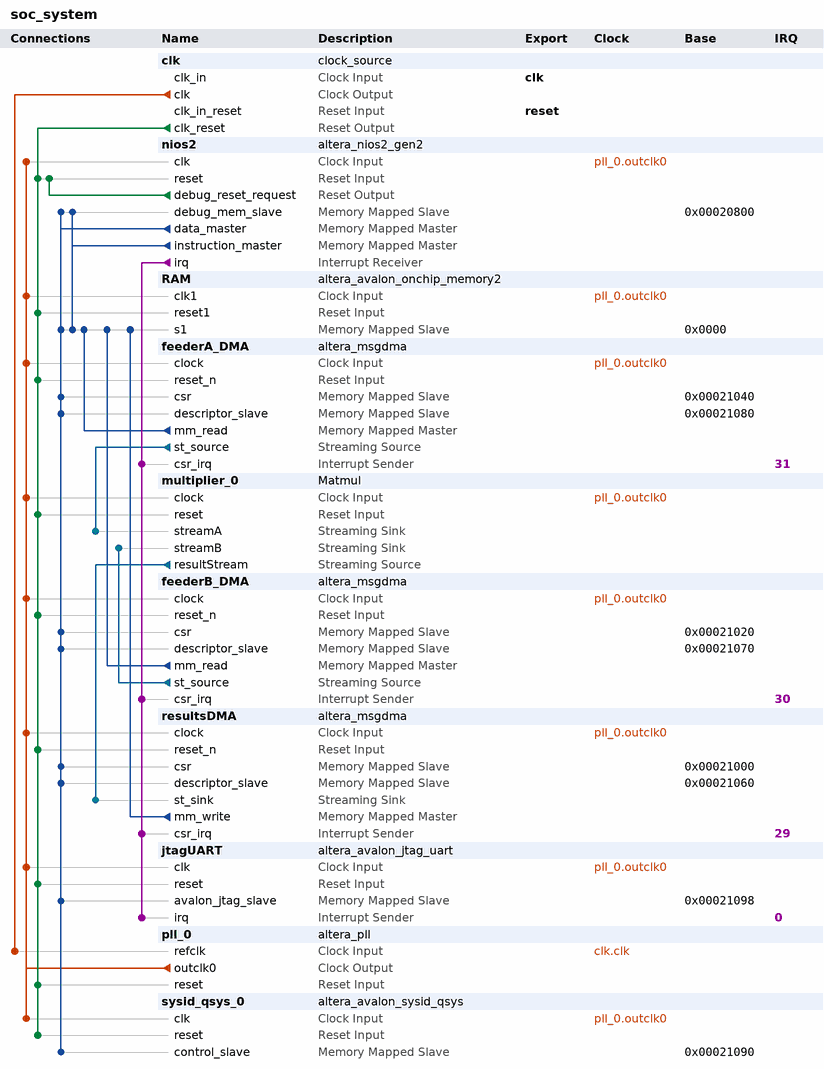
[diagram p0: system contents]
# Platform Designer (Qsys) system soc_system, Cyclone V 5CSEBA6U23I7
# Parameters at their usual value, and those the tool derives, are not listed.
package require -exact qsys 16.0
create_system soc_system
set_project_property DEVICE_FAMILY {Cyclone V}
set_project_property DEVICE 5CSEBA6U23I7

add_instance clk clock_source 16.0
set_instance_parameter_value clk clockFrequency 50000000

add_instance nios2 altera_nios2_gen2 16.0
set_instance_parameter_value nios2 dcache_size 2048
set_instance_parameter_value nios2 exceptionSlave RAM.s1
set_instance_parameter_value nios2 icache_size 4096
set_instance_parameter_value nios2 impl Tiny
set_instance_parameter_value nios2 resetSlave RAM.s1

add_instance RAM altera_avalon_onchip_memory2 16.0
set_instance_parameter_value RAM dataWidth 32
set_instance_parameter_value RAM dualPort false
set_instance_parameter_value RAM initMemContent true
set_instance_parameter_value RAM initializationFileName onchip_mem.hex
set_instance_parameter_value RAM memorySize 131072

add_instance feederA_DMA altera_msgdma 16.0
set_instance_parameter_value feederA_DMA BURST_ENABLE 1
set_instance_parameter_value feederA_DMA DATA_FIFO_DEPTH 32
set_instance_parameter_value feederA_DMA DATA_WIDTH 16
set_instance_parameter_value feederA_DMA DESCRIPTOR_FIFO_DEPTH 8
set_instance_parameter_value feederA_DMA ENHANCED_FEATURES 0
set_instance_parameter_value feederA_DMA ERROR_ENABLE 0
set_instance_parameter_value feederA_DMA MAX_BURST_COUNT 8
set_instance_parameter_value feederA_DMA MAX_BYTE 1024
set_instance_parameter_value feederA_DMA MODE 1
set_instance_parameter_value feederA_DMA PACKET_ENABLE 0
set_instance_parameter_value feederA_DMA TRANSFER_TYPE {Full Word Accesses Only}

add_instance multiplier_0 Matmul 1.0

add_instance feederB_DMA altera_msgdma 16.0
set_instance_parameter_value feederB_DMA BURST_ENABLE 1
set_instance_parameter_value feederB_DMA DATA_FIFO_DEPTH 32
set_instance_parameter_value feederB_DMA DATA_WIDTH 16
set_instance_parameter_value feederB_DMA DESCRIPTOR_FIFO_DEPTH 8
set_instance_parameter_value feederB_DMA ENHANCED_FEATURES 0
set_instance_parameter_value feederB_DMA ERROR_ENABLE 0
set_instance_parameter_value feederB_DMA MAX_BURST_COUNT 8
set_instance_parameter_value feederB_DMA MAX_BYTE 1024
set_instance_parameter_value feederB_DMA MODE 1
set_instance_parameter_value feederB_DMA PACKET_ENABLE 0
set_instance_parameter_value feederB_DMA TRANSFER_TYPE {Full Word Accesses Only}

add_instance resultsDMA altera_msgdma 16.0
set_instance_parameter_value resultsDMA BURST_ENABLE 1
set_instance_parameter_value resultsDMA DATA_FIFO_DEPTH 32
set_instance_parameter_value resultsDMA DATA_WIDTH 32
set_instance_parameter_value resultsDMA DESCRIPTOR_FIFO_DEPTH 8
set_instance_parameter_value resultsDMA ENHANCED_FEATURES 0
set_instance_parameter_value resultsDMA ERROR_ENABLE 0
set_instance_parameter_value resultsDMA MAX_BURST_COUNT 8
set_instance_parameter_value resultsDMA MAX_BYTE 1024
set_instance_parameter_value resultsDMA MODE 2
set_instance_parameter_value resultsDMA PACKET_ENABLE 0
set_instance_parameter_value resultsDMA TRANSFER_TYPE {Full Word Accesses Only}

add_instance jtagUART altera_avalon_jtag_uart 16.0
set_instance_parameter_value jtagUART simInteractiveOptions NO_INTERACTIVE_WINDOWS

add_instance pll_0 altera_pll 16.0
set_instance_parameter_value pll_0 gui_device_speed_grade 1
set_instance_parameter_value pll_0 gui_number_of_clocks 1
set_instance_parameter_value pll_0 gui_operation_mode direct
set_instance_parameter_value pll_0 gui_output_clock_frequency0 130.0
set_instance_parameter_value pll_0 gui_pll_mode {Integer-N PLL}
set_instance_parameter_value pll_0 gui_reference_clock_frequency 50.0
set_instance_parameter_value pll_0 gui_use_locked false

add_instance sysid_qsys_0 altera_avalon_sysid_qsys 16.0
set_instance_parameter_value sysid_qsys_0 id -559038737

# connections
add_connection clk.clk pll_0.refclk clock
add_connection pll_0.outclk0 feederA_DMA.clock clock
add_connection pll_0.outclk0 feederB_DMA.clock clock
add_connection pll_0.outclk0 jtagUART.clk clock
add_connection pll_0.outclk0 multiplier_0.clock clock
add_connection pll_0.outclk0 nios2.clk clock
add_connection pll_0.outclk0 RAM.clk1 clock
add_connection pll_0.outclk0 resultsDMA.clock clock
add_connection pll_0.outclk0 sysid_qsys_0.clk clock
add_connection clk.clk_reset feederA_DMA.reset_n reset
add_connection clk.clk_reset feederB_DMA.reset_n reset
add_connection clk.clk_reset jtagUART.reset reset
add_connection clk.clk_reset multiplier_0.reset reset
add_connection clk.clk_reset nios2.reset reset
add_connection clk.clk_reset pll_0.reset reset
add_connection clk.clk_reset RAM.reset1 reset
add_connection clk.clk_reset resultsDMA.reset_n reset
add_connection clk.clk_reset sysid_qsys_0.reset reset
add_connection nios2.debug_reset_request nios2.reset reset
add_connection feederA_DMA.mm_read RAM.s1 avalon
set_connection_parameter_value feederA_DMA.mm_read/RAM.s1 baseAddress 0x0000
add_connection feederB_DMA.mm_read RAM.s1 avalon
set_connection_parameter_value feederB_DMA.mm_read/RAM.s1 baseAddress 0x0000
add_connection nios2.data_master feederA_DMA.csr avalon
set_connection_parameter_value nios2.data_master/feederA_DMA.csr baseAddress 0x00021040
add_connection nios2.data_master feederA_DMA.descriptor_slave avalon
set_connection_parameter_value nios2.data_master/feederA_DMA.descriptor_slave baseAddress 0x00021080
add_connection nios2.data_master feederB_DMA.csr avalon
set_connection_parameter_value nios2.data_master/feederB_DMA.csr baseAddress 0x00021020
add_connection nios2.data_master feederB_DMA.descriptor_slave avalon
set_connection_parameter_value nios2.data_master/feederB_DMA.descriptor_slave baseAddress 0x00021070
add_connection nios2.data_master jtagUART.avalon_jtag_slave avalon
set_connection_parameter_value nios2.data_master/jtagUART.avalon_jtag_slave baseAddress 0x00021098
add_connection nios2.data_master nios2.debug_mem_slave avalon
set_connection_parameter_value nios2.data_master/nios2.debug_mem_slave baseAddress 0x00020800
add_connection nios2.data_master RAM.s1 avalon
set_connection_parameter_value nios2.data_master/RAM.s1 baseAddress 0x0000
add_connection nios2.data_master resultsDMA.csr avalon
set_connection_parameter_value nios2.data_master/resultsDMA.csr baseAddress 0x00021000
add_connection nios2.data_master resultsDMA.descriptor_slave avalon
set_connection_parameter_value nios2.data_master/resultsDMA.descriptor_slave baseAddress 0x00021060
add_connection nios2.data_master sysid_qsys_0.control_slave avalon
set_connection_parameter_value nios2.data_master/sysid_qsys_0.control_slave baseAddress 0x00021090
add_connection nios2.instruction_master nios2.debug_mem_slave avalon
set_connection_parameter_value nios2.instruction_master/nios2.debug_mem_slave baseAddress 0x00020800
add_connection nios2.instruction_master RAM.s1 avalon
set_connection_parameter_value nios2.instruction_master/RAM.s1 baseAddress 0x0000
add_connection resultsDMA.mm_write RAM.s1 avalon
set_connection_parameter_value resultsDMA.mm_write/RAM.s1 baseAddress 0x0000
add_connection feederA_DMA.st_source multiplier_0.streamA avalon_streaming
add_connection feederB_DMA.st_source multiplier_0.streamB avalon_streaming
add_connection multiplier_0.resultStream resultsDMA.st_sink avalon_streaming
add_connection nios2.irq feederA_DMA.csr_irq interrupt
set_connection_parameter_value nios2.irq/feederA_DMA.csr_irq irqNumber 31
add_connection nios2.irq feederB_DMA.csr_irq interrupt
set_connection_parameter_value nios2.irq/feederB_DMA.csr_irq irqNumber 30
add_connection nios2.irq jtagUART.irq interrupt
set_connection_parameter_value nios2.irq/jtagUART.irq irqNumber 0
add_connection nios2.irq resultsDMA.csr_irq interrupt
set_connection_parameter_value nios2.irq/resultsDMA.csr_irq irqNumber 29

# exported interfaces
add_interface clk clock sink
set_interface_property clk EXPORT_OF clk.clk_in
add_interface reset reset sink
set_interface_property reset EXPORT_OF clk.clk_in_reset

set_interconnect_requirement {$system} qsys_mm.clockCrossingAdapter HANDSHAKE
set_interconnect_requirement {$system} qsys_mm.maxAdditionalLatency 4

save_system soc_system.qsys
